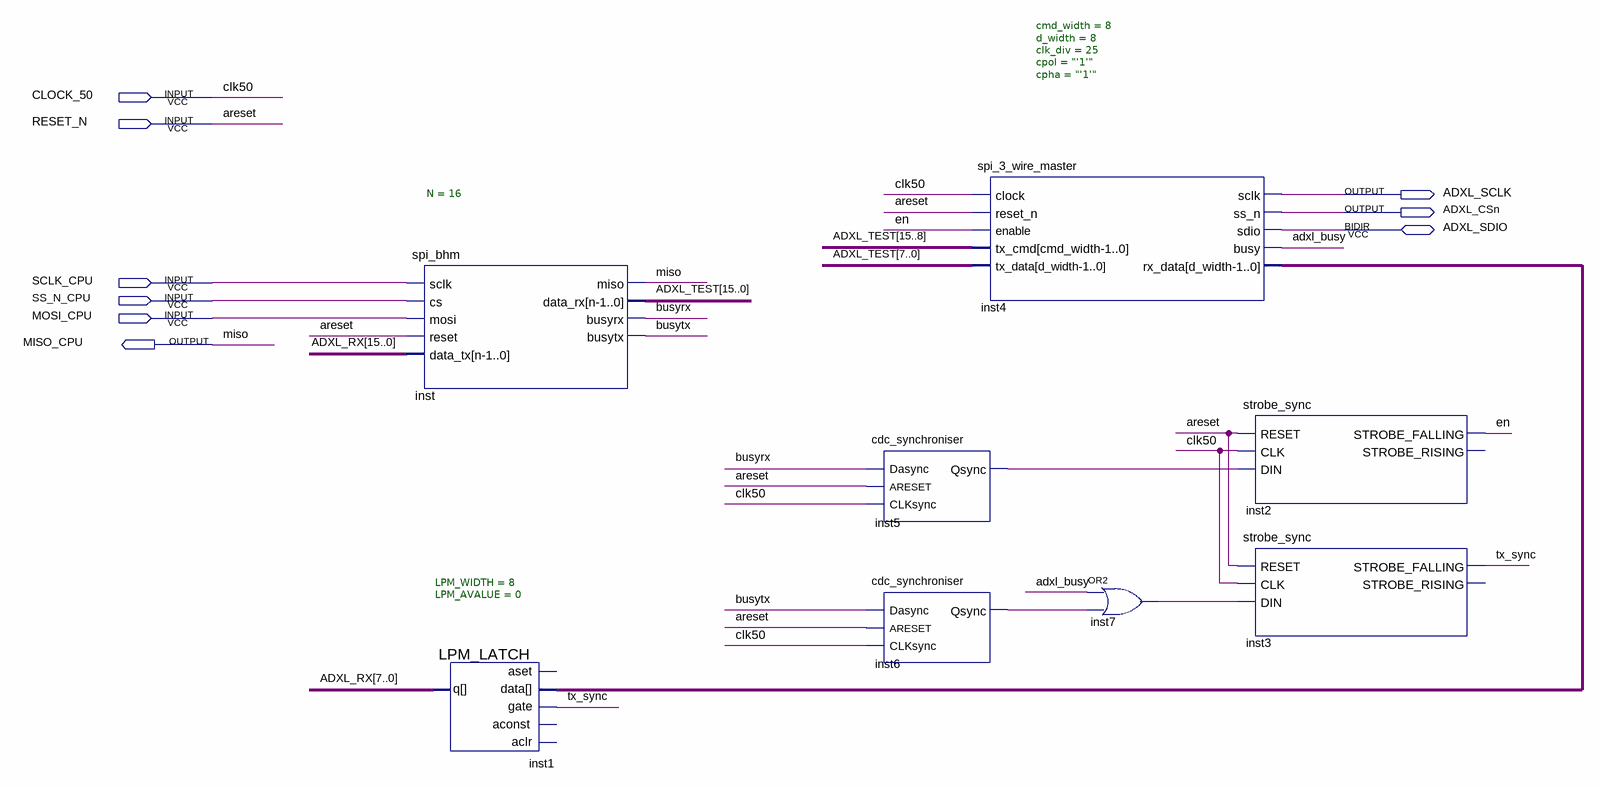
[diagram p0: schematic sheet]
// Quartus schematic AXDL345_Example.bdf as structural Verilog: 8 symbols, 9 pins
module AXDL345_Example (
  input  CLOCK_50,
  input  RESET_N,
  input  SCLK_CPU,
  input  SS_N_CPU,
  input  MOSI_CPU,
  inout  ADXL_SDIO,
  output ADXL_SCLK,
  output ADXL_CSn,
  output MISO_CPU
);

  wire adxl_busy, busyrx, busytx, en, inst5_qsync, inst6_qsync, inst7_out, tx_sync;
  wire [7:0] inst4_rx_data;
  wire [15:0] ADXL_RX, ADXL_TEST;

  spi_bhm #(.N(16)) inst (
    .sclk(SCLK_CPU), .cs(SS_N_CPU), .mosi(MOSI_CPU), .reset(RESET_N), .data_tx(ADXL_RX), .miso(MISO_CPU),
    .data_rx(ADXL_TEST), .busyrx(busyrx), .busytx(busytx));
  LPM_LATCH #(.LPM_WIDTH(8), .LPM_AVALUE(0)) inst1 (
    .data(inst4_rx_data), .gate(tx_sync), .q(ADXL_RX[7:0]));  // open: aset, aconst, aclr
  cdc_synchroniser inst5 (.Dasync(busyrx), .ARESET(RESET_N), .CLKsync(CLOCK_50), .Qsync(inst5_qsync));
  cdc_synchroniser inst6 (.Dasync(busytx), .ARESET(RESET_N), .CLKsync(CLOCK_50), .Qsync(inst6_qsync));
  spi_3_wire_master #(.cmd_width(8), .d_width(8), .clk_div(25), .cpol("'1'"), .cpha("'1'")) inst4 (
    .clock(CLOCK_50), .reset_n(RESET_N), .enable(en), .tx_cmd(ADXL_TEST[15:8]), .tx_data(ADXL_TEST[7:0]),
    .sclk(ADXL_SCLK), .ss_n(ADXL_CSn), .busy(adxl_busy), .rx_data(inst4_rx_data), .sdio(ADXL_SDIO));
  or inst7 (inst7_out, adxl_busy, inst6_qsync);
  strobe_sync inst2 (.RESET(RESET_N), .CLK(CLOCK_50), .DIN(inst5_qsync), .STROBE_FALLING(en));  // open: STROBE_RISING
  strobe_sync inst3 (
    .RESET(RESET_N), .CLK(CLOCK_50), .DIN(inst7_out), .STROBE_FALLING(tx_sync));  // open: STROBE_RISING

  // Other names for the same wires on the sheet: areset = RESET_N; clk50 = CLOCK_50; miso = MISO_CPU
endmodule
